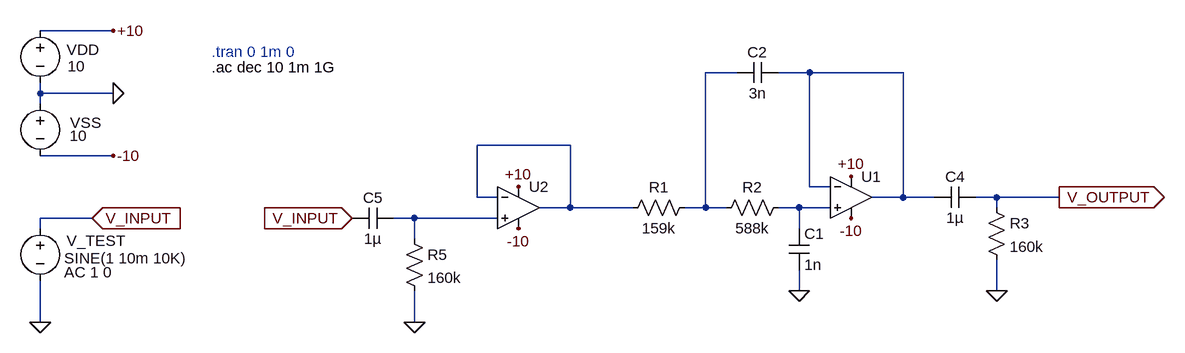
[diagram p0: schematic BP2.asc]
BP2.asc, the LTspice schematic file:
Version 4
SHEET 1 2296 680
WIRE 416 -400 304 -400
WIRE 1376 -336 1328 -336
WIRE 1488 -336 1440 -336
WIRE 1632 -336 1488 -336
WIRE 304 -304 304 -320
WIRE 416 -304 304 -304
WIRE 304 -288 304 -304
WIRE 1120 -224 976 -224
WIRE 416 -208 304 -208
WIRE 1488 -160 1488 -336
WIRE 1520 -160 1488 -160
WIRE 976 -144 976 -224
WIRE 1008 -144 976 -144
WIRE 1632 -144 1632 -336
WIRE 1632 -144 1584 -144
WIRE 1680 -144 1632 -144
WIRE 1776 -144 1744 -144
WIRE 1872 -144 1776 -144
WIRE 1120 -128 1120 -224
WIRE 1120 -128 1072 -128
WIRE 1216 -128 1120 -128
WIRE 1328 -128 1328 -336
WIRE 1328 -128 1296 -128
WIRE 1360 -128 1328 -128
WIRE 1472 -128 1440 -128
WIRE 1520 -128 1472 -128
WIRE 1776 -128 1776 -144
WIRE 384 -112 304 -112
WIRE 880 -112 848 -112
WIRE 1008 -112 880 -112
WIRE 304 -96 304 -112
WIRE 1472 -96 1472 -128
WIRE 880 -80 880 -112
WIRE 1472 0 1472 -32
WIRE 1776 0 1776 -48
WIRE 304 48 304 -16
WIRE 880 48 880 0
FLAG 416 -400 +10
FLAG 416 -208 -10
FLAG 416 -304 0
FLAG 1872 -144 V_OUTPUT
IOPIN 1872 -144 Out
FLAG 1552 -176 +10
FLAG 1552 -112 -10
FLAG 304 48 0
FLAG 384 -112 V_INPUT
IOPIN 384 -112 In
FLAG 1472 0 0
FLAG 1776 0 0
FLAG 1040 -160 +10
FLAG 1040 -96 -10
FLAG 880 48 0
FLAG 784 -112 V_INPUT
IOPIN 784 -112 In
DATAFLAG 1936 -144 ""
SYMBOL voltage 304 -416 R0
WINDOW 0 41 45 Left 2
WINDOW 3 42 70 Left 2
WINDOW 123 0 0 Left 0
WINDOW 39 0 0 Left 0
SYMATTR InstName VDD
SYMATTR Value 10
SYMBOL voltage 304 -304 R0
WINDOW 0 46 45 Left 2
WINDOW 3 45 65 Left 2
WINDOW 123 0 0 Left 0
WINDOW 39 0 0 Left 0
SYMATTR InstName VSS
SYMATTR Value 10
SYMBOL voltage 304 -112 R0
WINDOW 0 41 35 Left 2
WINDOW 3 37 62 Left 2
WINDOW 123 37 83 Left 2
WINDOW 39 0 0 Left 0
SYMATTR InstName V_TEST
SYMATTR Value SINE(1 10m 10K)
SYMATTR Value2 AC 1 0
SYMBOL res 1312 -144 R90
WINDOW 0 0 56 VBottom 2
WINDOW 3 32 56 VTop 2
SYMATTR InstName R1
SYMATTR Value 159k
SYMBOL res 1456 -144 R90
WINDOW 0 0 56 VBottom 2
WINDOW 3 32 56 VTop 2
SYMATTR InstName R2
SYMATTR Value 588k
SYMBOL cap 1440 -352 R90
WINDOW 0 0 32 VBottom 2
WINDOW 3 32 32 VTop 2
SYMATTR InstName C2
SYMATTR Value 3n
SYMBOL cap 1456 -96 R0
SYMATTR InstName C1
SYMATTR Value 1n
SYMBOL cap 1744 -160 R90
WINDOW 0 0 32 VBottom 2
WINDOW 3 32 32 VTop 2
SYMATTR InstName C4
SYMATTR Value 1µ
SYMBOL res 1760 -144 R0
SYMATTR InstName R3
SYMATTR Value 160k
SYMBOL cap 848 -128 R90
WINDOW 0 0 32 VBottom 2
WINDOW 3 32 32 VTop 2
SYMATTR InstName C5
SYMATTR Value 1µ
SYMBOL res 864 -96 R0
SYMATTR InstName R5
SYMATTR Value 160k
SYMBOL OpAmps\\UniversalOpAmp1 1040 -128 R0
SYMATTR InstName U2
SYMATTR Value2 Avol=205k GBW=4meg Vos=0
SYMBOL OpAmps\\UniversalOpAmp1 1552 -144 R0
SYMATTR InstName U1
SYMATTR Value2 Avol=205k GBW=4meg Vos=4m
SYMATTR SpiceLine En=0 Enk=0 In=0 Ink=0 Rin=100meg
TEXT 568 -368 Left 2 ;.tran 0 1m 0
TEXT 568 -344 Left 2 !.ac dec 10 1m 1G

The netlist it stands for:
* BP2.asc
VDD +10 0 10
VSS 0 -10 10
V_TEST V_INPUT 0 SINE(1 10m 10K) AC 1 0
R1 N001 N003 159k
R2 N004 N001 588k
C2 N002 N001 3n
C1 N004 0 1n
C4 V_OUTPUT N002 1µ
R3 V_OUTPUT 0 160k
C5 N005 V_INPUT 1µ
R5 N005 0 160k
XU2 N005 N003 +10 -10 N003 level1 Avol=205k GBW=4meg Vos=0 En=0 Enk=0 In=0 Ink=0 Rin=500Meg  ; pins In+ In- V+ V- OUT
XU1 N004 N002 +10 -10 N002 level1 Avol=205k GBW=4meg Vos=4m En=0 Enk=0 In=0 Ink=0 Rin=100meg  ; pins In+ In- V+ V- OUT
* .tran 0 1m 0
.ac dec 10 1m 1G
.lib UniversalOpAmp1.lib
.backanno
.end